# Altium schematic sheet USB Downstream Type C Port 3.SchDoc: DO NOT FILL THIS IN
size Tabloid; Date: DO NOT FILL THIS IN; ApprovedBy: DO NOT FILL THIS IN; CheckedBy: DO NOT FILL THIS IN; Author: DO NOT FILL THIS IN; CompanyName: DO NOT FILL THIS IN; DrawnBy: DO NOT FILL THIS IN; Engineer: DO NOT FILL THIS IN; Organization: DO NOT FILL THIS IN; Address1: DO NOT FILL THIS IN; Address2: DO NOT FILL THIS IN; Address3: DO NOT FILL THIS IN; Address4: DO NOT FILL THIS IN; DocumentNumber: DO NOT FILL THIS IN; Revision: DO NOT FILL THIS IN; SheetNumber: 7; SheetTotal: 9; PageSetup: Record=PageOptions|CenterHorizontal=True|CenterVertical=True|PrintScale=1.00|XCorrection=1.00|YCorrection=1.00|PrintKind=1|BorderSize=5000000|LeftOffset=0|BottomOffset=0|Orientation=2|PaperLength=1000|PaperWidth=1000|Scale=100|PaperSource=7|PrintQuality=-4|MediaType=1|DitherType=10|PaperKind=Ledger|PrintScaleMode=1; cpr-ItemNumber: 025619; cpr-ItemName1: TurtleBot4 UI board; cpr-ItemName2: Rev 2; cpr-Revision: 2; cpr-SheetNumber: 7; cpr-SheetTotal: 9; cpr-Draft: AG; cpr-DraftDate: 19/04/2022; Time: DO NOT FILL THIS IN; ImagePath: DO NOT FILL THIS IN; Application_BuildNumber: DO NOT FILL THIS IN
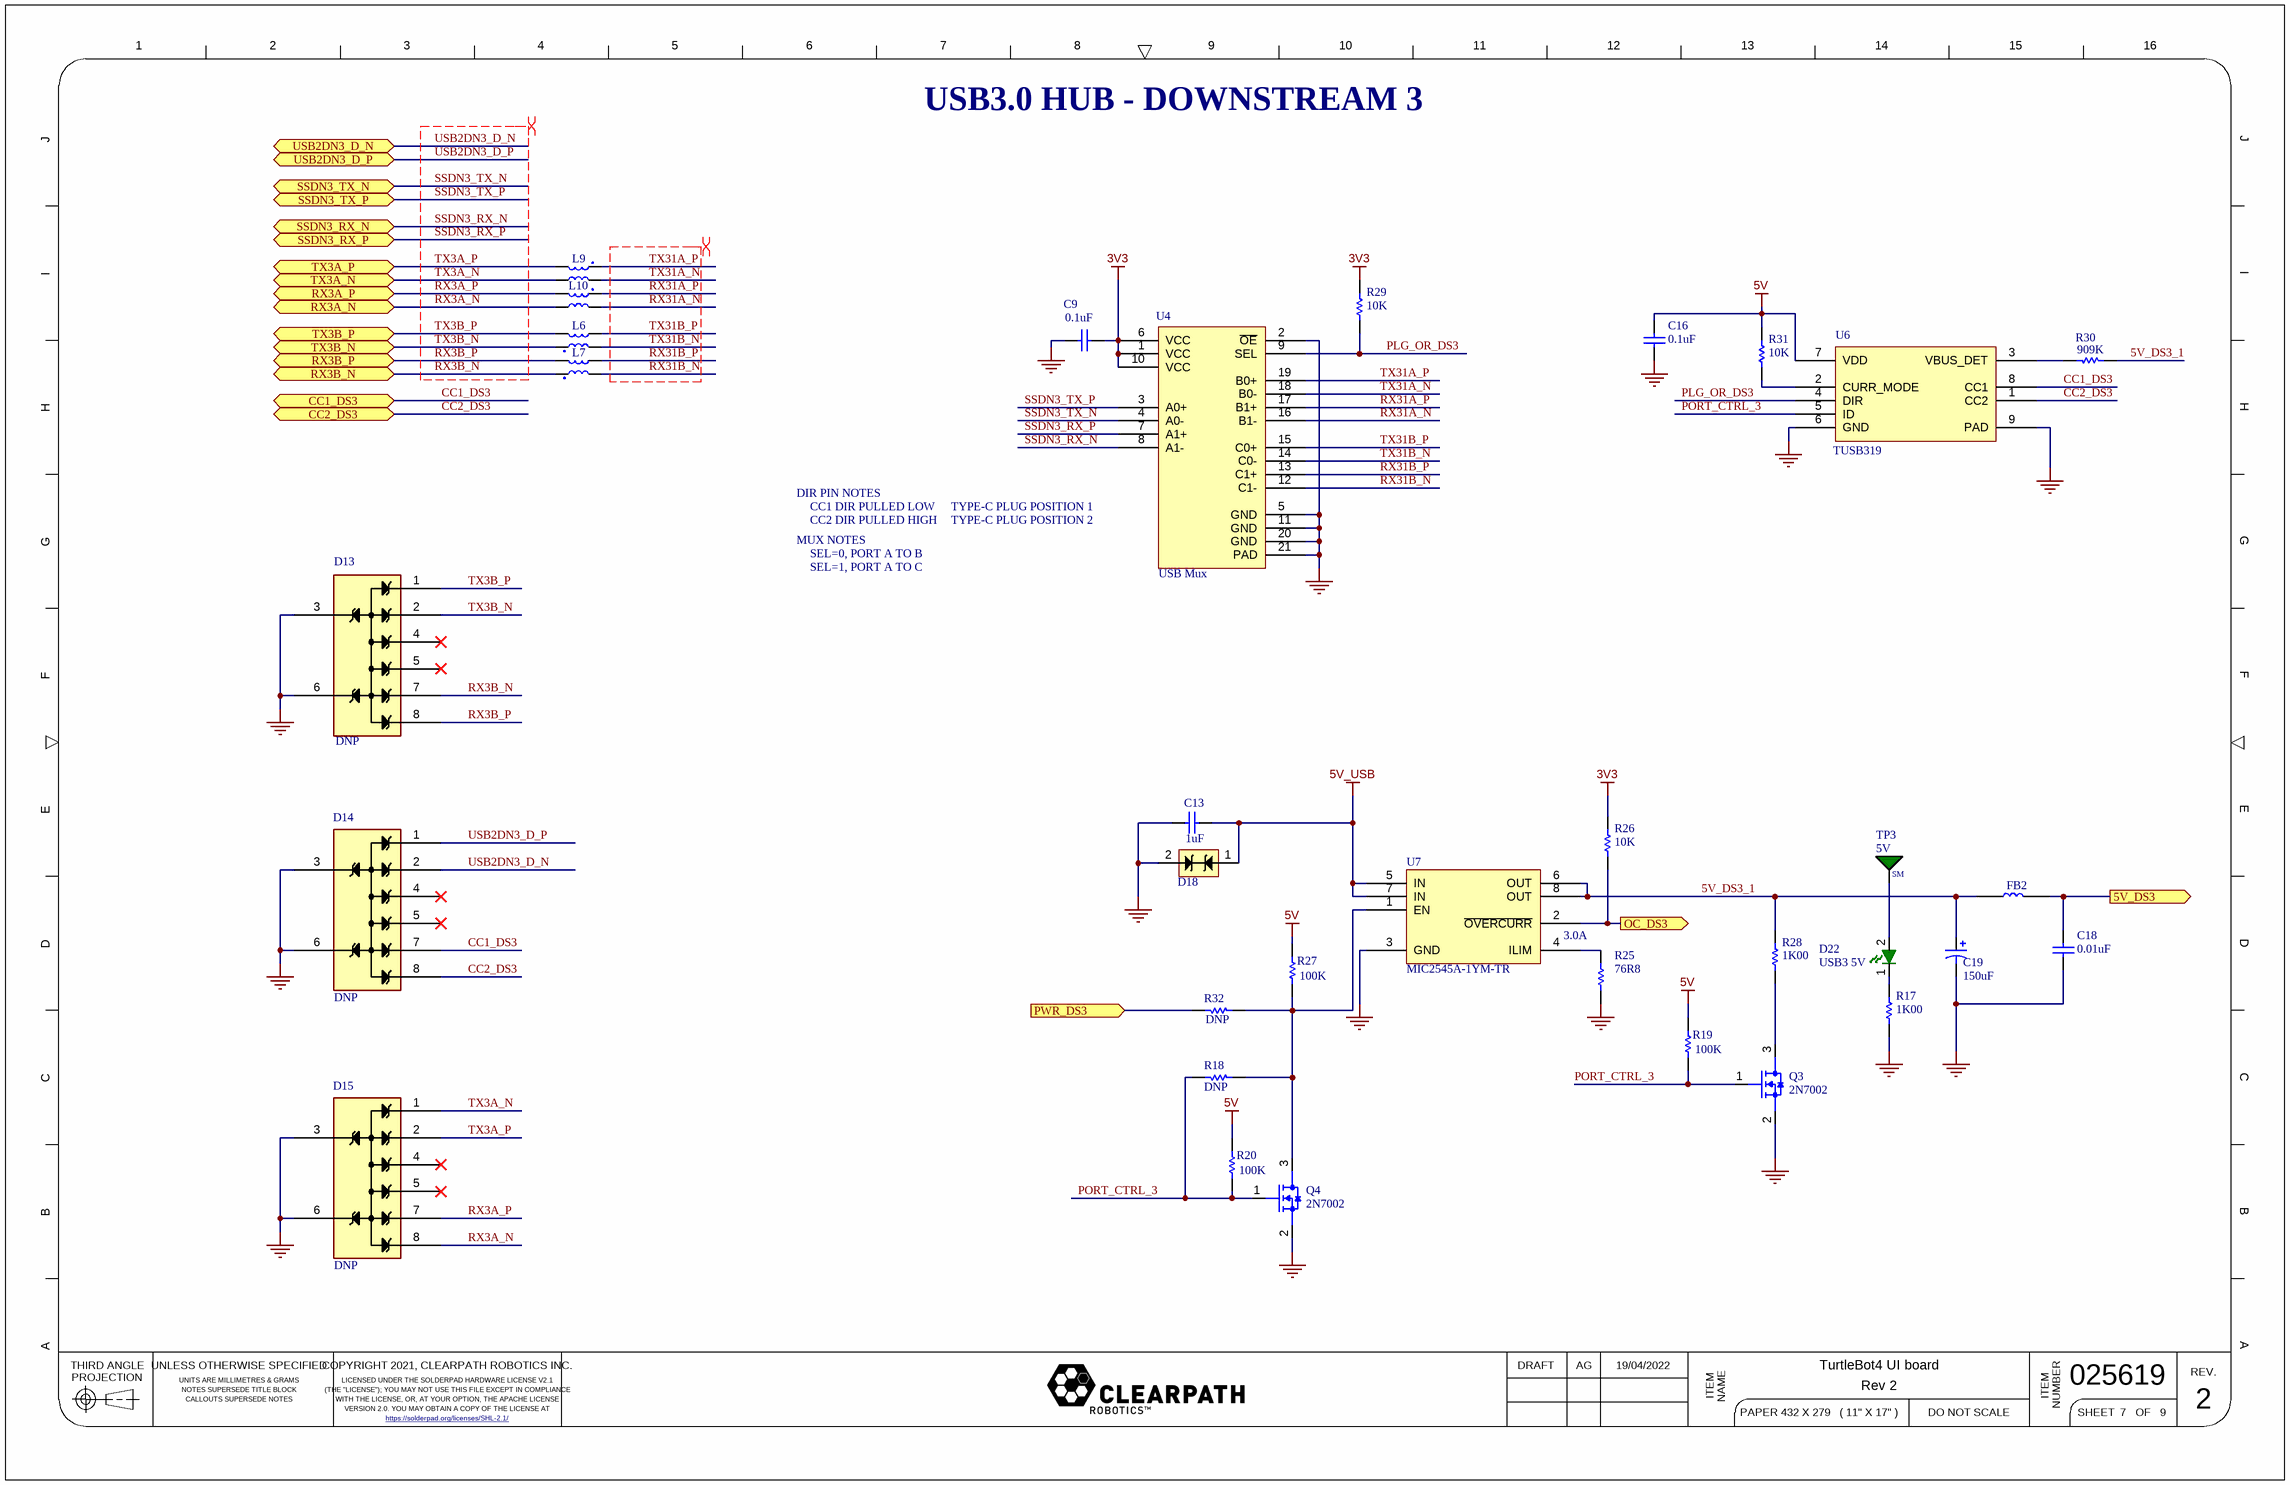
[diagram p0: USB Downstream Type C Port 3.SchDoc]

## Parts
C9  value 0.1uF  [C0805]  (hidden comment: Capacitor _SMT)
C13  value 1uF  [C0805]  (hidden comment: Capacitor _SMT)
C16  value 0.1uF  [C0805]  (hidden comment: Capacitor _SMT)
C18  value 0.01uF  [C0805]  (hidden comment: Capacitor _SMT)
C19  value 150uF  [CAPMP7.6X4.3_3.1N_KEM-M]  (hidden comment: Cap Tant)
D13  DNP  [ESD7016]
D14  DNP  [ESD7016]
D15  DNP  [ESD7016]
D18  TVS DIODE BIDIR 15V SMC  [DO-214AA]  (value not drawn)
D22  USB3 5V  [LED_0805_GRN]
FB2  742792602  [R0603]  (value not drawn)
L6  CMC 100MA 2LN 90 OHM SMD2  [cmc_90_ohms]  (value not drawn)
L7  CMC 100MA 2LN 90 OHM SMD2  [cmc_90_ohms]  (value not drawn)
L9  CMC 100MA 2LN 90 OHM SMD2  [cmc_90_ohms]  (value not drawn)
L10  CMC 100MA 2LN 90 OHM SMD2  [cmc_90_ohms]  (value not drawn)
Q3  Mfg PN: 2N7002  [SOT-23-3]  (hidden comment: NFET)
Q4  Mfg PN: 2N7002  [SOT-23-3]  (hidden comment: NFET)
R17  value 1K00  [R0805]  (hidden comment: Resistor_SMT)
R18  value DNP  [R0805]  (hidden comment: Resistor_SMT)
R19  value 100K  [R0805]  (hidden comment: Resistor_SMT)
R20  value 100K  [R0805]  (hidden comment: Resistor_SMT)
R25  3.0A  value 76R8  [R0805]
R26  value 10K  [R0805]  (hidden comment: Resistor_SMT)
R27  value 100K  [R0805]  (hidden comment: Resistor_SMT)
R28  value 1K00  [R0805]  (hidden comment: Resistor_SMT)
R29  value 10K  [R0805]  (hidden comment: Resistor_SMT)
R30  value 909K  [R0805]  (hidden comment: Resistor_SMT)
R31  value 10K  [R0805]  (hidden comment: Resistor_SMT)
R32  value DNP  [R0805]  (hidden comment: Resistor_SMT)
TP3  5V  [TP_28SM]
U4  USB Mux  [TQFN20]
U6  TUSB319  [WSON8]
U7  Mfg PN: MIC2545A-1YM-TR  [SOIC-8-150]  (hidden comment: MIC2545_USB_SWITCH)

## Ports
5V_DS3 (out), CC1_DS3 (bidir), CC2_DS3 (bidir), OC_DS3 (out), PWR_DS3 (in), RX3A_N (bidir), RX3A_P (bidir), RX3B_N (bidir), RX3B_P (bidir), SSDN3_RX_N (bidir), SSDN3_RX_P (bidir), SSDN3_TX_N (bidir), SSDN3_TX_P (bidir), TX3A_N (bidir), TX3A_P (bidir), TX3B_N (bidir), TX3B_P (bidir), USB2DN3_D_N (bidir), USB2DN3_D_P (bidir)

## Nets
3V3: C9.1 R26.1 R29.1 U4.1(VCC) U4.6(VCC) U4.10(VCC)
5V: C16.1 R19.2 R20.2 R27.2 R31.1 U6.7(VDD)
5V_USB: C13.2 D18.1 U7.5(IN) U7.7(IN)
GND: C9.2 C13.1 C16.2 C18.2 C19.2 D13.3 D13.6 D14.3 D14.6 D15.3 D15.6 D18.2 Q3.2(D1) Q4.2(D1) R17.2 R25.1 U4.2(~{OE}) U4.5(GND) U4.11(GND) U4.20(GND) U4.21(PAD) U6.6(GND) U6.9(PAD) U7.3(GND)
5V_DS3: C18.1 FB2.2 ; port 5V_DS3
5V_DS3_1: C19.1 FB2.1 R28.1 R30.2 U7.6(OUT) U7.8(OUT)
CC1_DS3: D14.7 U6.8(CC1) ; port CC1_DS3
CC2_DS3: D14.8 U6.1(CC2) ; port CC2_DS3
OC_DS3: R26.2 U7.2(~{OVERCURR}) ; port OC_DS3
PLG_OR_DS3: R29.2 U4.9(SEL) U6.4(DIR)
PORT_CTRL_3: Q3.1(G1) Q4.1(G1) R18.1 R19.1 R20.1 U6.5(ID)
PWR_DS3: R32.1 ; port PWR_DS3
RX3A_N: D15.8 L10.3 ; port RX3A_N
RX3A_P: D15.7 L10.4 ; port RX3A_P
RX3B_N: D13.7 L7.1 ; port RX3B_N
RX3B_P: D13.8 L7.2 ; port RX3B_P
RX31A_N: L10.2 U4.16(B1-)
RX31A_P: L10.1 U4.17(B1+)
RX31B_N: L7.4 U4.12(C1-)
RX31B_P: L7.3 U4.13(C1+)
SSDN3_RX_N: U4.8(A1-) ; port SSDN3_RX_N
SSDN3_RX_P: U4.7(A1+) ; port SSDN3_RX_P
SSDN3_TX_N: U4.4(A0-) ; port SSDN3_TX_N
SSDN3_TX_P: U4.3(A0+) ; port SSDN3_TX_P
TX3A_N: D15.1 L9.3 ; port TX3A_N
TX3A_P: D15.2 L9.4 ; port TX3A_P
TX3B_N: D13.2 L6.1 ; port TX3B_N
TX3B_P: D13.1 L6.2 ; port TX3B_P
TX31A_N: L9.2 U4.18(B0-)
TX31A_P: L9.1 U4.19(B0+)
TX31B_N: L6.4 U4.14(C0-)
TX31B_P: L6.3 U4.15(C0+)
USB2DN3_D_N: D14.2 ; port USB2DN3_D_N
USB2DN3_D_P: D14.1 ; port USB2DN3_D_P
NetD22_1: D22.1(RK) R17.1
NetD22_2: D22.2(RA) TP3.1
NetQ3_3: Q3.3(S1) R28.2
NetQ4_3: Q4.3(S1) R18.2 R27.1 R32.2 U7.1(EN)
NetR25_2: R25.2 U7.4(ILIM)
NetR30_1: R30.1 U6.3(VBUS_DET)
NetR31_2: R31.2 U6.2(CURR_MODE)

Not connected (* = marked no-connect by the designer): D13 4* 5*; D14 4* 5*; D15 4* 5*

## Layout directives
differential pair; net class USB3; differential pair class DIFF90; rule Matched Net Lengths [Tolerance = 15mil]: RX3A_N, RX3A_P, RX3B_N, RX3B_P, RX31A_N, RX31A_P, RX31B_N, RX31B_P, SSDN3_RX_N, SSDN3_RX_P, SSDN3_TX_N, SSDN3_TX_P, TX3A_N, TX3A_P, TX3B_N, TX3B_P, TX31A_N, TX31A_P, TX31B_N, TX31B_P, USB2DN3_D_N, USB2DN3_D_P

## Notes on the sheet
- USB3.0 HUB - DOWNSTREAM 3
- DIR PIN NOTES
- MUX NOTES
- CC1 DIR PULLED LOW
- CC2 DIR PULLED HIGH
- SEL=0, PORT A TO B
- SEL=1, PORT A TO C
- TYPE-C PLUG POSITION 1
- TYPE-C PLUG POSITION 2
- 1
- 2
- 3
- 4
- 5
- 6
- 7
- 8
- 9
- 10
- 11
- 12
- 13
- 14
- 15
- 16
- J
- I
- H
- G
- F
- E
- D
- C
- B
- A
- THIRD ANGLE
- PROJECTION
- UNLESS OTHERWISE SPECIFIED
- COPYRIGHT 2021, CLEARPATH ROBOTICS INC.
- DRAFT
- REV.
- UNITS ARE MILLIMETRES & GRAMS
- NOTES SUPERSEDE TITLE BLOCK
- CALLOUTS SUPERSEDE NOTES
- LICENSED UNDER THE SOLDERPAD HARDWARE LICENSE V2.1
- (THE "LICENSE"); YOU MAY NOT USE THIS FILE EXCEPT IN COMPLIANCE
- WITH THE LICENSE, OR, AT YOUR OPTION, THE APACHE LICENSE
- VERSION 2.0. YOU MAY OBTAIN A COPY OF THE LICENSE AT
- https://solderpad.org/licenses/SHL-2.1/ <https://solderpad.https://solderpad.org/licenses/SHL-2.1/org/licenses/SHL-2.1/>
- ITEM
- NAME
- PAPER 432 X 279   ( 11" X 17" )
- DO NOT SCALE
- NUMBER
- SHEET
- OF
- (in symbol TP_28SM) SM

## Library data of the parts
C9 C16 = Capacitor _SMT: Capacitor; Tolerance: 10%; Voltage: 50V; Vendor: Digikey; Vendor PN: 311-1140-1-ND; Mfg: Yageo; Mfg PN: CC0805KRX7R9BB104; DNP: *; Package: 0805
C13 = Capacitor _SMT: Capacitor; Tolerance: -20 +80; Voltage: 50V; Vendor: Digikey; Vendor PN: 311-1909-1-ND; Mfg: Yageo; Mfg PN: CC0805ZKY5V9BB105; DNP: *; Package: 0805
C18 = Capacitor _SMT: Capacitor; Tolerance: 10%; Voltage: 50V; Vendor: Digikey; Vendor PN: 1276-CL10B103KB8WPNDCT-ND; Mfg: Samsung Electro-Mechanics; Mfg PN: CL10B103KB8WPND; DNP: *; Package: 0603; Supplier 1: Digi-Key; Supplier Part Number 1: 1276-CL10B103KB8WPNDCT-ND
C19 = Cap Pol1: CAP TANT 150UF 10% 16V 2917; Vendor: Digikey; Mfg PN: 293D157X9016D2TE3; Vendor PN: 718-1746-1-ND; Mfg: Vishay Sprague; Voltage: 16V; Tolerance: 10%; Package: 2917; Supplier 1: Digi-Key; Supplier Part Number 1: 718-1746-1-ND
D13-D15 = ESD7016: USB3 TVS diode assy; Vendor 1: Digikey; Vendor 1 PN: ESD7016MUTAGOSCT-ND; Mfg: ON Semi; Mfg PN: ESD7016MUTAG; Vendor 2 PN: *; Vendor 2: *
D18 = TVS DIODE BIDIR 15V SMC: TVS 600W 15V BI-DIR DO-214AA; Vendor: Digikey; Vendor PN: 18-SMA6J5.0CACT-ND; Mfg: Littelfuse Inc.; Mfg PN: SMA6J5.0CA; Package: DO214AC; Supplier 1: Digi-Key; Supplier Part Number 1: 18-SMA6J5.0CACT-ND
D22 = GREEN_LED: Green LED; Vendor: Digikey; Mfg PN: LTST-C170KGKT; Mfg: LiteOn; Vendor 1: 160-1414-1-ND; Package: 0805
FB2 = 742792602: 60 Ohms 1 Signal Line Ferrite Bead 0603 (1608 Metric) 3A 40mOhm; Supplier 1: Digi-Key; Supplier Part Number 1: 732-4660-1-ND
L6 L7 L9 L10 = CMC 90_Ohms: Line Common Mode Choke Surface Mount 90 Ohms 100mA DCR 5Ohm; Supplier 1: Digi-Key; Supplier Part Number 1: 490-16595-1-ND
Q3 Q4 = NFET_SNGL: Vendor: Digikey; Vendor PN: 2N7002NCT-ND; Mfg: ON Semi; Package: SOT23-3
R17 R28 = Resistor_SMT: Resistor; Vendor: Digikey; Vendor PN: 311-1.00KCRCT-ND; Tolerance: 1%; Mfg: Yageo; Mfg PN: RC0805FR-071KL; Power Rating: *; Package: 0805
R18 R32 = Resistor_SMT: Resistor; Vendor: Digikey; Vendor PN: 311-0.0ARCT-ND; Mfg: Yageo; Mfg PN: RC0805JR-070RL; Power Rating: *; Package: 0805
R19 R20 R27 = Resistor_SMT: Resistor; Vendor: Digikey; Vendor PN: 311-100KCRCT-ND; Tolerance: 1%; Mfg: Yageo; Mfg PN: RC0805FR-07100KL; Power Rating: *; Package: 0805
R25 = Resistor_SMT: Resistor; Vendor: Digikey; Vendor PN: 311-76.8CRCT-ND; Tolerance: 1%; Mfg: Yageo; Mfg PN: RC0805FR-0776R8L; Power Rating: *; Package: 0805
R26 R29 R31 = Resistor_SMT: Resistor; Vendor: Digikey; Vendor PN: 311-10.0KCRCT-ND; Tolerance: 1%; Mfg: Yageo; Mfg PN: RC0805FR-0710KL; Power Rating: *; Package: 0805
  R26: Supplier 1: Digi-Key; Supplier Part Number 1: 311-10.0KCRTR-ND
R30 = Resistor_SMT: Resistor; Vendor: Digikey; Vendor PN: 311-909KCRCT-ND; Tolerance: 1%; Mfg: Yageo; Mfg PN: RC0805FR-07909KL; Power Rating: *; Package: 0805
TP3 = TP_28SM: Test point, 28 Mil exposed pad; Manufacturer: Clearpath Robotics Inc.; ID: 1; PCB Component: TP_28SM; Status: Draft; Vendor: Clearpath Robotics Inc.; Vendor PN: TP_28SM; Type: SM Pad; Features: Exposed 28mil pad; Octopart Link: N/A
U4 = TC7PCI3212: TC7PCI3212MT,LF USB3.0 Mux; Manufacturer: Toshiba; Vendor 1 PN: 757-TC7PCI3212MTLF; Vendor 1: Mouser; Package: TQFN-20; Mfg PN: TC7PCI3212MT,LF
U6 = TUSB319: USB Type C Controller; Vendor 1 PN: 595-TUSB319IDRFRQ1; Vendor 1: Mouser; Mfg PN: TUSB319IDRFRQ1; Mfg: Texas Instruments; Package: WSON8
U7 = MIC2545_USB_SWITCH: IC PWR SWITCH N-CHAN 1:1 8SOIC; Manufacturer: Microchip; Vendor PN: MIC2545A-1YM-CT-ND; Vendor: Digikey; Package: SOIC8